# EAGLE design 7seg (EAGLE 7.6.0)
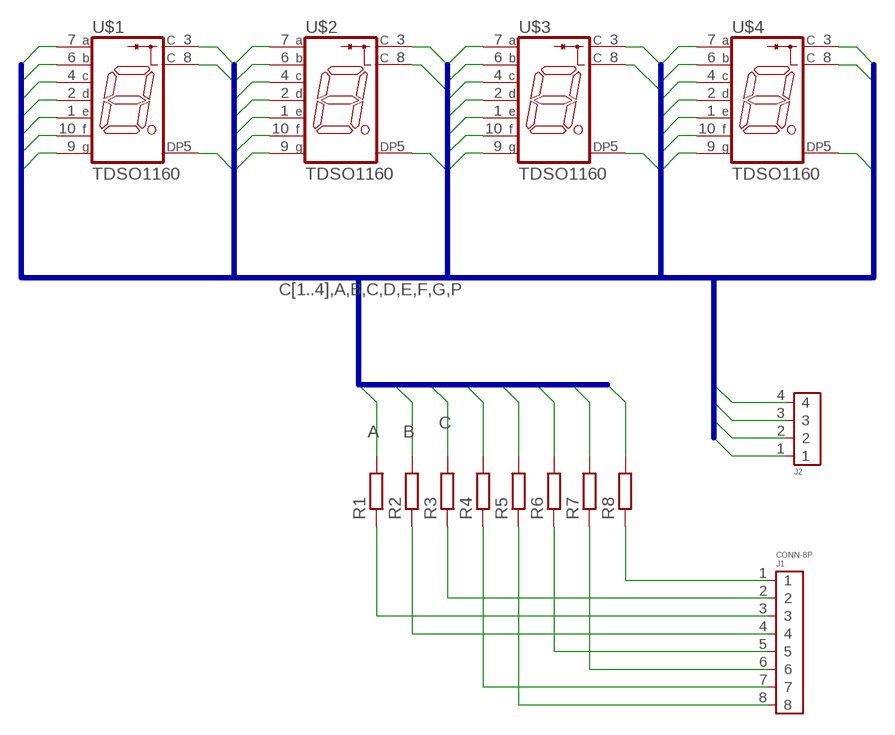
[diagram p0: schematic, sheet 1]

## Parts
J1  CONN-8P  [CONN-8P]
J2  CONN-4P-4P  [CONN-4P]
R1  R0202/7-V  [0202/7-V]
R2  R0202/7-V  [0202/7-V]
R3  R0202/7-V  [0202/7-V]
R4  R0202/7-V  [0202/7-V]
R5  R0202/7-V  [0202/7-V]
R6  R0202/7-V  [0202/7-V]
R7  R0202/7-V  [0202/7-V]
R8  R0202/7-V  [0202/7-V]
U$1  TDSO1160  [TDSX1150]
U$2  TDSO1160  [TDSX1150]
U$3  TDSO1160  [TDSX1150]
U$4  TDSO1160  [TDSX1150]

## Nets
A: R1.2 U$1.7(A) U$2.7(A) U$3.7(A) U$4.7(A)
B: R2.2 U$1.6(B) U$2.6(B) U$3.6(B) U$4.6(B)
C: R3.2 U$1.4(C) U$2.4(C) U$3.4(C) U$4.4(C)
C1: J2.1 U$1.3(C) U$1.8(C)
C2: J2.2 U$2.3(C) U$2.8(C)
C3: J2.3 U$3.3(C) U$3.8(C)
C4: J2.4 U$4.3(C) U$4.8(C)
D: R4.2 U$1.2(D) U$2.2(D) U$3.2(D) U$4.2(D)
E: R5.2 U$1.1(E) U$2.1(E) U$3.1(E) U$4.1(E)
F: R6.2 U$1.10(F) U$2.10(F) U$3.10(F) U$4.10(F)
G: R7.2 U$1.9(G) U$2.9(G) U$3.9(G) U$4.9(G)
N$1: J1.3 R1.1
N$2: J1.4 R2.1
N$3: J1.2 R3.1
N$4: J1.7 R4.1
N$5: J1.8 R5.1
N$6: J1.5 R6.1
N$7: J1.6 R7.1
N$8: J1.1 R8.1
P: R8.2 U$1.5(DP) U$2.5(DP) U$3.5(DP) U$4.5(DP)

## Buses
C[1..4],A,B,C,D,E,F,G,P

## Library data of the parts
J1 = pinconn:CONN-8P
J2 = pinconn:CONN-4P
R1-R8 = r:R: RESISTOR, European symbol
U$1-U$4 = lcd:TDSO1160

## Board
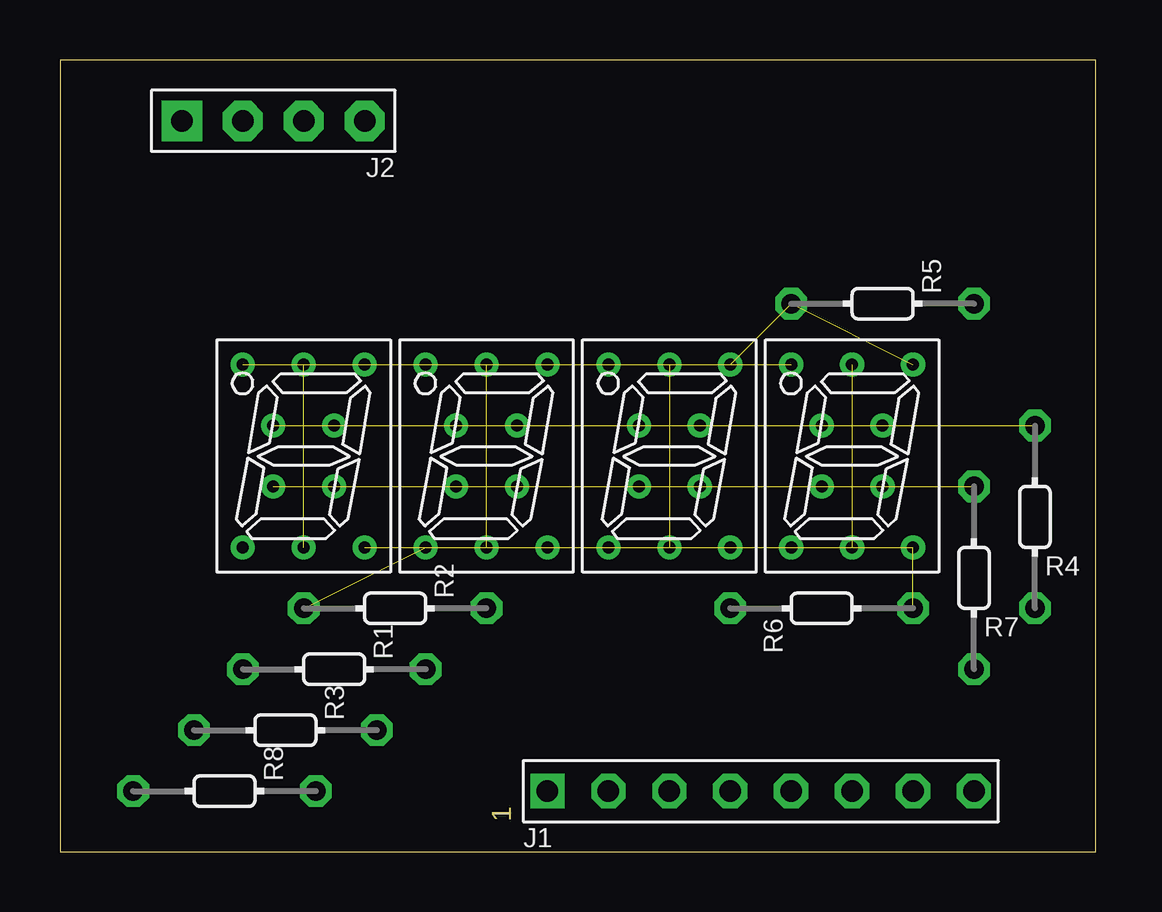
[diagram p1: board, top side]
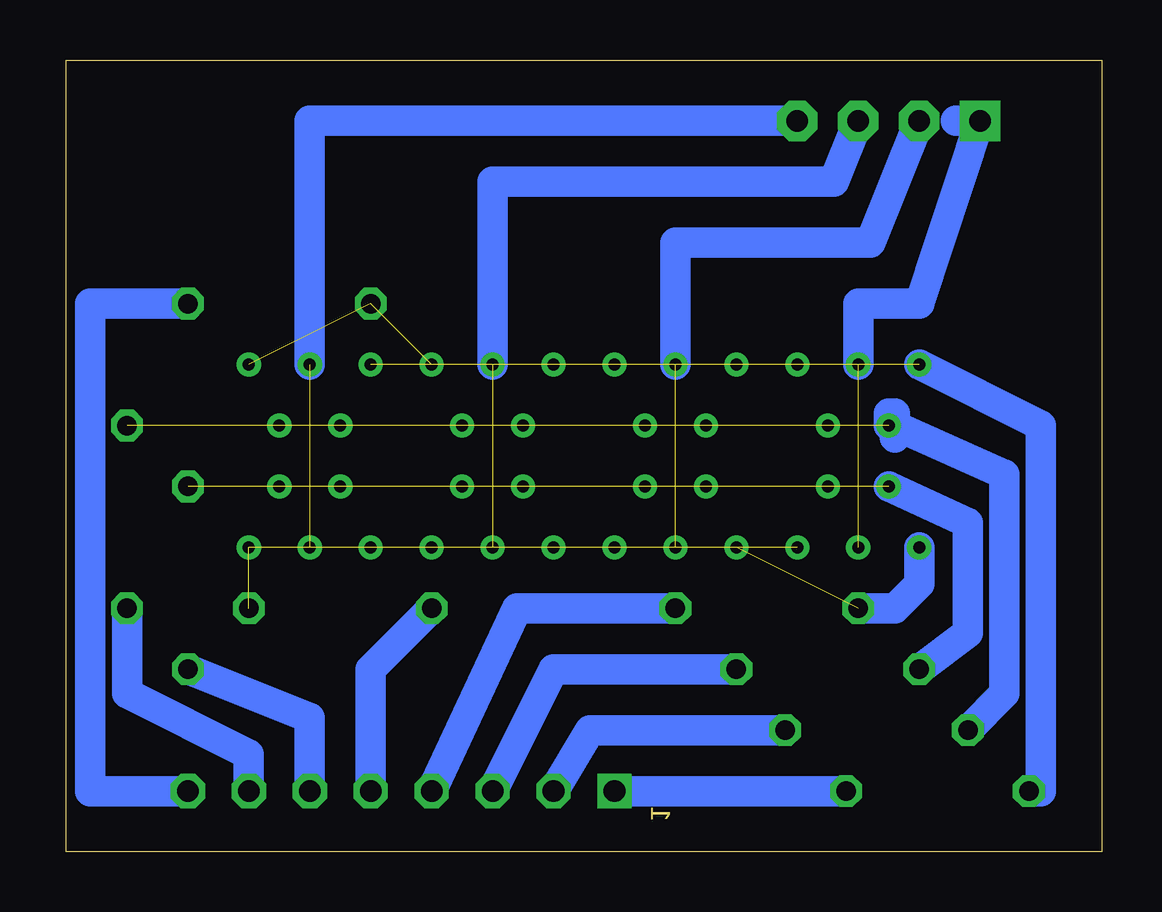
[diagram p2: board, bottom side, seen from below]

Size 43.18 x 33 mm. Coordinates in mm from the lower left corner, seen from the top.
Outline: 0,33 0,0 43.18,0 43.18,33 0,33
Copper layers (1*16): Top 0.035mm / dielectric 1.5mm / Bottom 0.035mm
Design rules "default": minimum track width 10mil, minimum drill 24mil, track to track 8mil, track to pad 8mil, pad to pad 8mil, via to via 8mil, smd to smd 8mil, copper to edge 40mil, drill to drill 8mil, minimum pad ring 10mil, minimum via ring 8mil, stop-mask expansion 4mil, vias tented up to drill 0mil, thermal gap 10mil

### Footprints (pad centres in the part's own frame; a part is rotated, then mirrored left to right if it is on the bottom)
CONN-8P = drill 0.9 pad 1.422 square: 1 -8.89,0 | drill 0.9 pad 1.422 octagon: 2 -6.35,0; 3 -3.81,0; 4 -1.27,0; 5 1.27,0; 6 3.81,0; 7 6.35,0; 8 8.89,0
CONN-4P = drill 0.9 pad 1.676 square: 1 -3.81,0 | drill 0.9 pad 1.676 octagon: 2 -1.27,0; 3 1.27,0; 4 3.81,0
0202/7-V = drill 0.813 octagon: 1 0,-3.81; 2 0,3.81
TDSX1150 = drill 0.5: 1 -2.54,-3.81; 2 -1.27,-1.27; 3 0,-3.81; 4 1.27,-1.27; 5 2.54,-3.81; 6 2.54,3.81; 7 1.27,1.27; 8 0,3.81; 9 -1.27,1.27; 10 -2.54,3.81

### Placement (x,y rotation side)
J1  29.21,2.52 0 top
J2  8.89,30.46 0 top
R1  11.43,7.6 90 top
R2  13.97,10.14 90 top
R3  9.4,5.06 90 top
R4  40.64,13.95 0 top
R5  34.29,22.84 90 top
R6  31.75,10.14 270 top
R7  38.1,11.41 0 top
R8  6.86,2.52 90 top
U$1  10.16,16.49 180 top
U$2  17.78,16.49 180 top
U$3  25.4,16.49 180 top
U$4  33.02,16.49 180 top

### Tracks (layer width: path | path; a pad name or v marks a point on that pad's centre or on a via)
A  (3 unrouted)
  Bottom 1.27: U$1.7 5.59,13.7 5.59,9.12 R1.2
B  (3 unrouted)
  Bottom 1.27: R2.2 8.64,10.14 7.62,11.16 U$1.6
C  (3 unrouted)
  Bottom 1.27: R3.2 4.06,6.58 4.06,15.73 8.64,17.76 | 8.64,17.76 8.64,17.25 | 8.64,17.76 8.64,18.27 8.89,18.27 U$1.4
C1  (1 unrouted)
  Bottom 1.27: 6.1,30.46 J2.1 7.62,22.84 10.16,22.84 U$1.3
C2  (1 unrouted)
  Bottom 1.27: J2.2 9.65,25.38 17.78,25.38 U$2.3
C3  (1 unrouted)
  Bottom 1.27: J2.3 11.18,27.92 25.4,27.92 U$3.3
C4  (1 unrouted)
  Bottom 1.27: J2.4 33.02,30.46 U$4.3
D  (4 unrouted)
E  (4 unrouted)
F  (4 unrouted)
G  (4 unrouted)
N$1
  Bottom 1.27: R1.1 22.86,7.6 J1.3
N$2
  Bottom 1.27: R2.1 24.38,10.14 J1.4
N$3
  Bottom 1.27: R3.1 21.34,5.06 J1.2
N$4
  Bottom 1.27: J1.7 35.56,4.04 40.64,6.58 R4.1
N$5
  Bottom 1.27: J1.8 42.16,2.52 42.16,22.84 R5.1
N$6
  Bottom 1.27: R6.1 30.48,7.6 J1.5
N$7
  Bottom 1.27: J1.6 33.02,5.57 R7.1
N$8
  Bottom 1.27: R8.1 J1.1
P  (3 unrouted)
  Bottom 1.27: R8.2 2.54,2.52 2.54,17.76 U$1.5